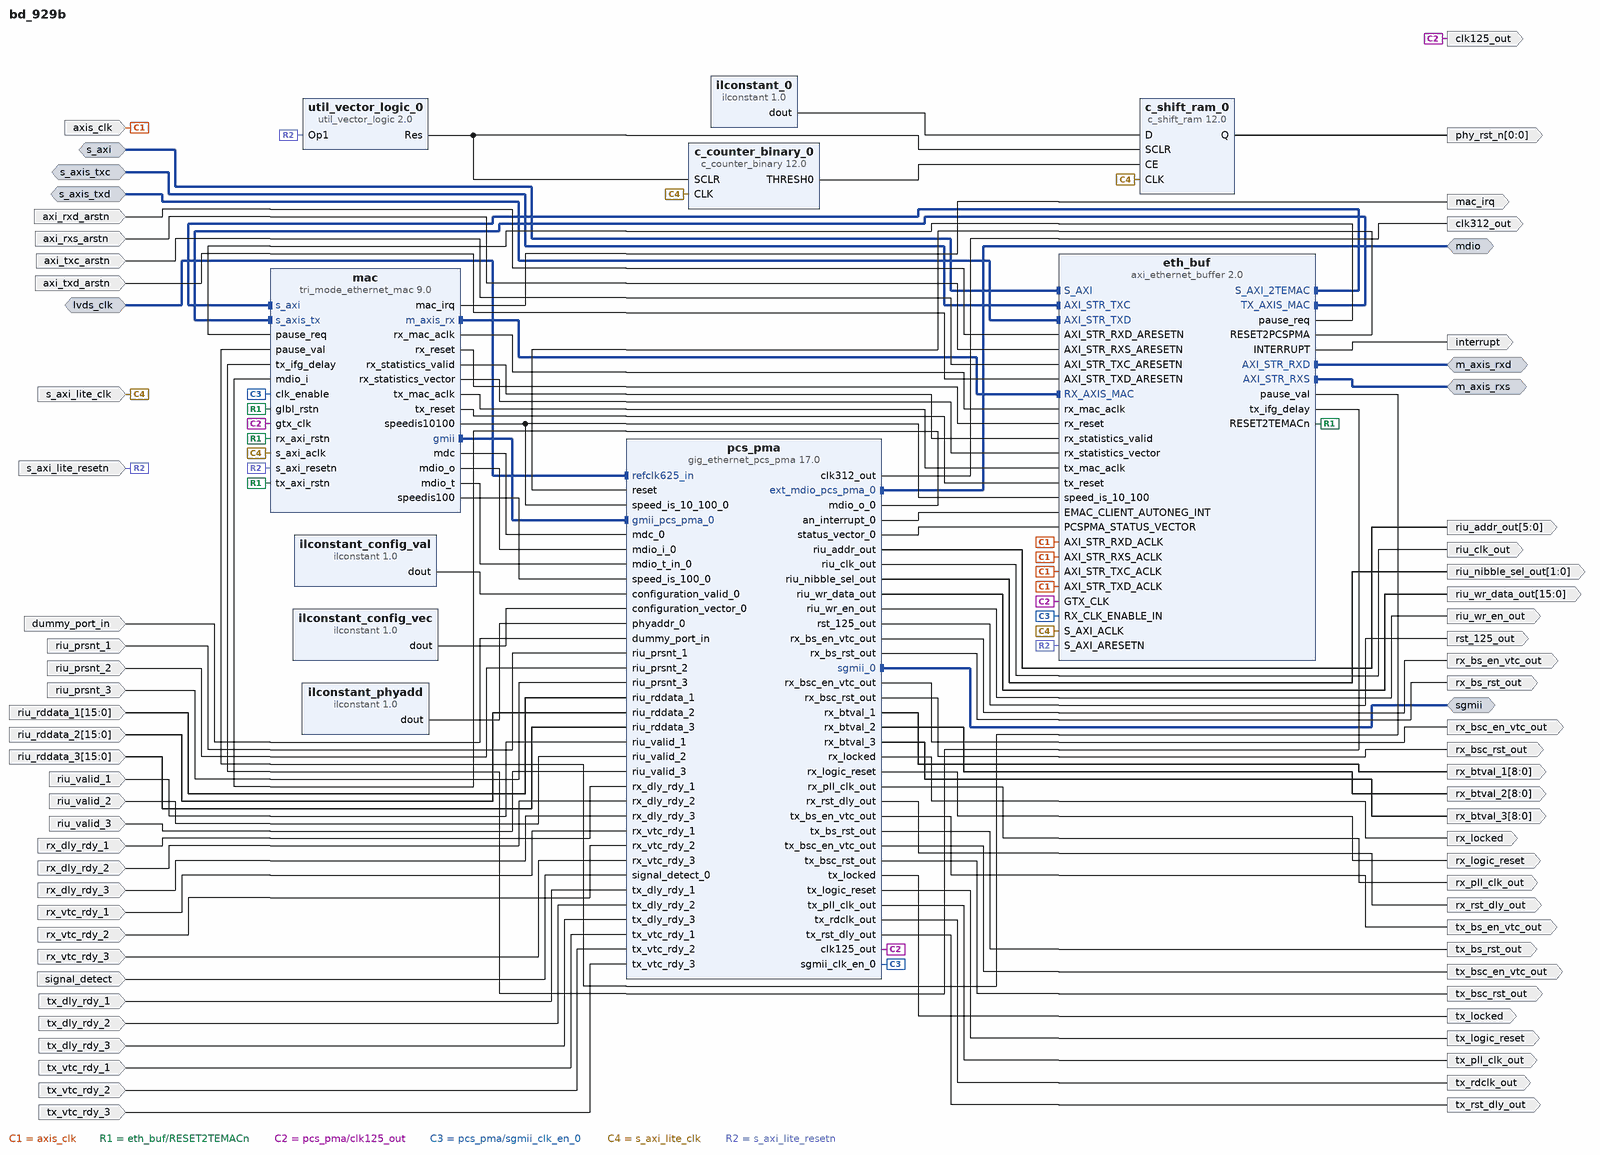
[diagram p0: block diagram of the top level]
# Vivado block design bd_929b, xcvu37p-fsvh2892-2L-e, Vivado 2025.2
create_bd_design bd_929b

create_bd_intf_port -mode Slave -vlnv xilinx.com:interface:aximm_rtl:1.0 s_axi
set_property -dict {CONFIG.ADDR_WIDTH 18 CONFIG.PROTOCOL AXI4LITE} [get_bd_intf_ports s_axi]
create_bd_intf_port -mode Slave -vlnv xilinx.com:interface:axis_rtl:1.0 s_axis_txd
create_bd_intf_port -mode Slave -vlnv xilinx.com:interface:axis_rtl:1.0 s_axis_txc
create_bd_intf_port -mode Master -vlnv xilinx.com:interface:axis_rtl:1.0 m_axis_rxd
create_bd_intf_port -mode Master -vlnv xilinx.com:interface:axis_rtl:1.0 m_axis_rxs
create_bd_intf_port -mode Master -vlnv xilinx.com:interface:mdio_rtl:1.0 mdio
create_bd_intf_port -mode Master -vlnv xilinx.com:interface:sgmii_rtl:1.0 sgmii
create_bd_intf_port -mode Slave -vlnv xilinx.com:interface:diff_clock_rtl:1.0 lvds_clk
set_property -dict {CONFIG.TYPE ETH_LVDS_CLK} [get_bd_intf_ports lvds_clk]
create_bd_port -dir I -type rst s_axi_lite_resetn
set_property -dict {CONFIG.POLARITY ACTIVE_LOW} [get_bd_ports s_axi_lite_resetn]
create_bd_port -dir I -type clk s_axi_lite_clk
set_property -dict {CONFIG.ASSOCIATED_BUSIF s_axi CONFIG.ASSOCIATED_RESET s_axi_lite_resetn} [get_bd_ports s_axi_lite_clk]
create_bd_port -dir O -type intr mac_irq
set_property -dict {CONFIG.SENSITIVITY EDGE_RISING} [get_bd_ports mac_irq]
create_bd_port -dir I -type clk axis_clk
set_property -dict [list \
  CONFIG.ASSOCIATED_BUSIF m_axis_rxd:m_axis_rxs:s_axis_txc:s_axis_txd \
  CONFIG.ASSOCIATED_RESET axi_rxd_arstn:axi_rxs_arstn:axi_txc_arstn:axi_txd_arstn \
] [get_bd_ports axis_clk]
create_bd_port -dir I -type rst axi_txd_arstn
set_property -dict {CONFIG.POLARITY ACTIVE_LOW} [get_bd_ports axi_txd_arstn]
create_bd_port -dir I -type rst axi_txc_arstn
set_property -dict {CONFIG.POLARITY ACTIVE_LOW} [get_bd_ports axi_txc_arstn]
create_bd_port -dir I -type rst axi_rxd_arstn
set_property -dict {CONFIG.POLARITY ACTIVE_LOW} [get_bd_ports axi_rxd_arstn]
create_bd_port -dir I -type rst axi_rxs_arstn
set_property -dict {CONFIG.POLARITY ACTIVE_LOW} [get_bd_ports axi_rxs_arstn]
create_bd_port -dir O -type intr interrupt
set_property -dict {CONFIG.SENSITIVITY LEVEL_HIGH} [get_bd_ports interrupt]
create_bd_port -dir I signal_detect
create_bd_port -dir O -type clk clk125_out
set_property -dict {CONFIG.ASSOCIATED_RESET rst_125_out} [get_bd_ports clk125_out]
create_bd_port -dir O -type clk clk312_out
create_bd_port -dir O -type rst rst_125_out
set_property -dict {CONFIG.POLARITY ACTIVE_HIGH} [get_bd_ports rst_125_out]
create_bd_port -dir I riu_valid_3
create_bd_port -dir I riu_valid_2
create_bd_port -dir I riu_valid_1
create_bd_port -dir I riu_prsnt_3
create_bd_port -dir I riu_prsnt_2
create_bd_port -dir I riu_prsnt_1
create_bd_port -dir I -from 15 -to 0 riu_rddata_3
create_bd_port -dir I -from 15 -to 0 riu_rddata_2
create_bd_port -dir I -from 15 -to 0 riu_rddata_1
create_bd_port -dir I tx_dly_rdy_1
create_bd_port -dir I rx_dly_rdy_1
create_bd_port -dir I tx_vtc_rdy_1
create_bd_port -dir I rx_vtc_rdy_1
create_bd_port -dir I tx_dly_rdy_2
create_bd_port -dir I rx_dly_rdy_2
create_bd_port -dir I tx_vtc_rdy_2
create_bd_port -dir I rx_vtc_rdy_2
create_bd_port -dir I tx_dly_rdy_3
create_bd_port -dir I rx_dly_rdy_3
create_bd_port -dir I tx_vtc_rdy_3
create_bd_port -dir I rx_vtc_rdy_3
create_bd_port -dir O tx_logic_reset
create_bd_port -dir O rx_logic_reset
create_bd_port -dir O rx_locked
create_bd_port -dir O tx_locked
create_bd_port -dir O tx_bsc_rst_out
create_bd_port -dir O rx_bsc_rst_out
create_bd_port -dir O tx_bs_rst_out
create_bd_port -dir O rx_bs_rst_out
create_bd_port -dir O tx_rst_dly_out
create_bd_port -dir O rx_rst_dly_out
create_bd_port -dir O tx_bsc_en_vtc_out
create_bd_port -dir O tx_bs_en_vtc_out
create_bd_port -dir O rx_bsc_en_vtc_out
create_bd_port -dir O rx_bs_en_vtc_out
create_bd_port -dir O riu_clk_out
create_bd_port -dir O riu_wr_en_out
create_bd_port -dir O tx_pll_clk_out
create_bd_port -dir O rx_pll_clk_out
create_bd_port -dir O tx_rdclk_out
create_bd_port -dir O -from 5 -to 0 riu_addr_out
create_bd_port -dir O -from 15 -to 0 riu_wr_data_out
create_bd_port -dir O -from 1 -to 0 riu_nibble_sel_out
create_bd_port -dir O -from 8 -to 0 rx_btval_1
create_bd_port -dir O -from 8 -to 0 rx_btval_2
create_bd_port -dir O -from 8 -to 0 rx_btval_3
create_bd_port -dir I -type rst dummy_port_in
set_property -dict {CONFIG.POLARITY ACTIVE_HIGH} [get_bd_ports dummy_port_in]
create_bd_port -dir O -from 0 -to 0 -type rst phy_rst_n
set_property -dict {CONFIG.POLARITY ACTIVE_LOW} [get_bd_ports phy_rst_n]

create_bd_cell -type ip -vlnv xilinx.com:ip:axi_ethernet_buffer:2.0 eth_buf
set_property -dict [list \
  CONFIG.C_AVB 0 \
  CONFIG.C_PHYADDR 1 \
  CONFIG.C_PHY_TYPE 4 \
  CONFIG.C_STATS 1 \
  CONFIG.C_TYPE 1 \
  CONFIG.ENABLE_LVDS 1 \
  CONFIG.HAS_SGMII true \
  CONFIG.MCAST_EXTEND false \
  CONFIG.PHYRST_BOARD_INTERFACE Custom \
  CONFIG.RXCSUM None \
  CONFIG.RXMEM 4k \
  CONFIG.RXVLAN_STRP false \
  CONFIG.RXVLAN_TAG false \
  CONFIG.RXVLAN_TRAN false \
  CONFIG.SIMULATION_MODE false \
  CONFIG.SPEED_2P5 false \
  CONFIG.TXCSUM None \
  CONFIG.TXMEM 4k \
  CONFIG.TXVLAN_STRP false \
  CONFIG.TXVLAN_TAG false \
  CONFIG.TXVLAN_TRAN false \
  CONFIG.USE_BOARD_FLOW true \
  CONFIG.enable_1588 0 \
] [get_bd_cells eth_buf]
create_bd_cell -type ip -vlnv xilinx.com:ip:tri_mode_ethernet_mac:9.0 mac
set_property -dict [list \
  CONFIG.Data_Rate 1_Gbps \
  CONFIG.ETHERNET_BOARD_INTERFACE Custom \
  CONFIG.Enable_1588 false \
  CONFIG.Enable_AVB false \
  CONFIG.Enable_MDIO true \
  CONFIG.Enable_Priority_Flow_Control false \
  CONFIG.Frame_Filter true \
  CONFIG.Int_Mode_Type SGMII \
  CONFIG.MAC_Speed Tri_speed \
  CONFIG.MDIO_BOARD_INTERFACE Custom \
  CONFIG.Make_MDIO_External false \
  CONFIG.Management_Interface true \
  CONFIG.Number_of_Table_Entries 4 \
  CONFIG.Physical_Interface Internal \
  CONFIG.Statistics_Counters true \
  CONFIG.Statistics_Reset false \
  CONFIG.Statistics_Width 64bit \
  CONFIG.USE_BOARD_FLOW FALSE \
] [get_bd_cells mac]
create_bd_cell -type ip -vlnv xilinx.com:ip:gig_ethernet_pcs_pma:17.0 pcs_pma
set_property -dict [list \
  CONFIG.Auto_Negotiation TRUE \
  CONFIG.ClockSelection Sync \
  CONFIG.DIFFCLK_BOARD_INTERFACE sgmii_phyclk \
  CONFIG.DrpClkRate 50.0 \
  CONFIG.ETHERNET_BOARD_INTERFACE sgmii_lvds \
  CONFIG.EXAMPLE_SIMULATION 0 \
  CONFIG.EnableAsyncSGMII false \
  CONFIG.Enable_1588 false \
  CONFIG.GT_Location X0Y0 \
  CONFIG.GT_Type GTY \
  CONFIG.GTinEx false \
  CONFIG.IS_GT_WIZ_OLD 0 \
  CONFIG.InstantiateBitslice0 true \
  CONFIG.LvdsRefClk 625 \
  CONFIG.MDIO_BOARD_INTERFACE mdio_mdc \
  CONFIG.Management_Interface TRUE \
  CONFIG.MaxDataRate 1G \
  CONFIG.NumOfLanes 1 \
  CONFIG.RefClkRate 125 \
  CONFIG.RefClkSrc clk0 \
  CONFIG.RxLane0_Placement DIFF_PAIR_2 \
  CONFIG.RxNibbleBitslice0Used false \
  CONFIG.SGMII_Mode 10_100_1000 \
  CONFIG.SGMII_PHY_Mode FALSE \
  CONFIG.SupportLevel Include_Shared_Logic_in_Core \
  CONFIG.TransceiverControl false \
  CONFIG.TxLane0_Placement DIFF_PAIR_1 \
  CONFIG.Tx_In_Upper_Nibble 1 \
  CONFIG.USE_BOARD_FLOW true \
] [get_bd_cells pcs_pma]
create_bd_cell -type inline_hdl -vlnv xilinx.com:inline_hdl:ilconstant:1.0 ilconstant_phyadd
set_property -dict {CONFIG.CONST_VAL 1 CONFIG.CONST_WIDTH 5} [get_bd_cells ilconstant_phyadd]
create_bd_cell -type inline_hdl -vlnv xilinx.com:inline_hdl:ilconstant:1.0 ilconstant_config_vec
set_property -dict {CONFIG.CONST_VAL 16 CONFIG.CONST_WIDTH 5} [get_bd_cells ilconstant_config_vec]
create_bd_cell -type inline_hdl -vlnv xilinx.com:inline_hdl:ilconstant:1.0 ilconstant_config_val
set_property -dict {CONFIG.CONST_VAL 1 CONFIG.CONST_WIDTH 1} [get_bd_cells ilconstant_config_val]
create_bd_cell -type ip -vlnv xilinx.com:ip:c_shift_ram:12.0 c_shift_ram_0
set_property -dict [list \
  CONFIG.AsyncInitVal 0 \
  CONFIG.CE true \
  CONFIG.DefaultData 0 \
  CONFIG.Depth 1 \
  CONFIG.SCLR true \
  CONFIG.Width 1 \
] [get_bd_cells c_shift_ram_0]
create_bd_cell -type ip -vlnv xilinx.com:ip:c_counter_binary:12.0 c_counter_binary_0
set_property -dict [list \
  CONFIG.Final_Count_Value 300000 \
  CONFIG.Increment_Value 1 \
  CONFIG.Output_Width 24 \
  CONFIG.Restrict_Count true \
  CONFIG.SCLR true \
  CONFIG.Sync_Threshold_Output true \
  CONFIG.Threshold_Value 300000 \
] [get_bd_cells c_counter_binary_0]
create_bd_cell -type inline_hdl -vlnv xilinx.com:inline_hdl:ilconstant:1.0 ilconstant_0
create_bd_cell -type ip -vlnv xilinx.com:ip:util_vector_logic:2.0 util_vector_logic_0
set_property -dict {CONFIG.C_OPERATION not CONFIG.C_SIZE 1} [get_bd_cells util_vector_logic_0]

# ---- connections ----

connect_bd_intf_net [get_bd_intf_ports m_axis_rxd] [get_bd_intf_pins eth_buf/AXI_STR_RXD]
connect_bd_intf_net [get_bd_intf_ports m_axis_rxs] [get_bd_intf_pins eth_buf/AXI_STR_RXS]
connect_bd_intf_net [get_bd_intf_pins eth_buf/S_AXI_2TEMAC] [get_bd_intf_pins mac/s_axi]
connect_bd_intf_net [get_bd_intf_pins eth_buf/TX_AXIS_MAC] [get_bd_intf_pins mac/s_axis_tx]
connect_bd_intf_net [get_bd_intf_ports lvds_clk] [get_bd_intf_pins pcs_pma/refclk625_in]
connect_bd_intf_net [get_bd_intf_pins mac/gmii] [get_bd_intf_pins pcs_pma/gmii_pcs_pma_0]
connect_bd_intf_net [get_bd_intf_pins eth_buf/RX_AXIS_MAC] [get_bd_intf_pins mac/m_axis_rx]
connect_bd_intf_net [get_bd_intf_ports mdio] [get_bd_intf_pins pcs_pma/ext_mdio_pcs_pma_0]
connect_bd_intf_net [get_bd_intf_ports sgmii] [get_bd_intf_pins pcs_pma/sgmii_0]
connect_bd_intf_net [get_bd_intf_ports s_axi] [get_bd_intf_pins eth_buf/S_AXI]
connect_bd_intf_net [get_bd_intf_ports s_axis_txc] [get_bd_intf_pins eth_buf/AXI_STR_TXC]
connect_bd_intf_net [get_bd_intf_ports s_axis_txd] [get_bd_intf_pins eth_buf/AXI_STR_TXD]
connect_bd_net [get_bd_ports axi_rxd_arstn] [get_bd_pins eth_buf/AXI_STR_RXD_ARESETN]
connect_bd_net [get_bd_ports axi_rxs_arstn] [get_bd_pins eth_buf/AXI_STR_RXS_ARESETN]
connect_bd_net [get_bd_ports axi_txc_arstn] [get_bd_pins eth_buf/AXI_STR_TXC_ARESETN]
connect_bd_net [get_bd_ports axi_txd_arstn] [get_bd_pins eth_buf/AXI_STR_TXD_ARESETN]
connect_bd_net [get_bd_ports axis_clk] \
  [get_bd_pins eth_buf/AXI_STR_RXS_ACLK] [get_bd_pins eth_buf/AXI_STR_RXD_ACLK] [get_bd_pins eth_buf/AXI_STR_TXC_ACLK] \
  [get_bd_pins eth_buf/AXI_STR_TXD_ACLK]
connect_bd_net [get_bd_pins c_counter_binary_0/THRESH0] [get_bd_pins c_shift_ram_0/CE]
connect_bd_net [get_bd_pins c_shift_ram_0/Q] [get_bd_ports phy_rst_n]
connect_bd_net [get_bd_ports dummy_port_in] [get_bd_pins pcs_pma/dummy_port_in]
connect_bd_net [get_bd_pins eth_buf/INTERRUPT] [get_bd_ports interrupt]
connect_bd_net [get_bd_pins eth_buf/RESET2PCSPMA] [get_bd_pins pcs_pma/reset]
connect_bd_net [get_bd_pins eth_buf/RESET2TEMACn] [get_bd_pins mac/glbl_rstn] [get_bd_pins mac/rx_axi_rstn] [get_bd_pins mac/tx_axi_rstn]
connect_bd_net [get_bd_pins eth_buf/pause_req] [get_bd_pins mac/pause_req]
connect_bd_net [get_bd_pins eth_buf/pause_val] [get_bd_pins mac/pause_val]
connect_bd_net [get_bd_pins eth_buf/tx_ifg_delay] [get_bd_pins mac/tx_ifg_delay]
connect_bd_net [get_bd_pins ilconstant_0/dout] [get_bd_pins c_shift_ram_0/D]
connect_bd_net [get_bd_pins ilconstant_config_val/dout] [get_bd_pins pcs_pma/configuration_valid_0]
connect_bd_net [get_bd_pins ilconstant_config_vec/dout] [get_bd_pins pcs_pma/configuration_vector_0]
connect_bd_net [get_bd_pins ilconstant_phyadd/dout] [get_bd_pins pcs_pma/phyaddr_0]
connect_bd_net [get_bd_pins mac/mac_irq] [get_bd_ports mac_irq]
connect_bd_net [get_bd_pins mac/mdc] [get_bd_pins pcs_pma/mdc_0]
connect_bd_net [get_bd_pins mac/mdio_o] [get_bd_pins pcs_pma/mdio_i_0]
connect_bd_net [get_bd_pins mac/mdio_t] [get_bd_pins pcs_pma/mdio_t_in_0]
connect_bd_net [get_bd_pins mac/rx_mac_aclk] [get_bd_pins eth_buf/rx_mac_aclk]
connect_bd_net [get_bd_pins mac/rx_reset] [get_bd_pins eth_buf/rx_reset]
connect_bd_net [get_bd_pins mac/rx_statistics_valid] [get_bd_pins eth_buf/rx_statistics_valid]
connect_bd_net [get_bd_pins mac/rx_statistics_vector] [get_bd_pins eth_buf/rx_statistics_vector]
connect_bd_net [get_bd_pins mac/speedis100] [get_bd_pins pcs_pma/speed_is_100_0]
connect_bd_net [get_bd_pins mac/speedis10100] [get_bd_pins eth_buf/speed_is_10_100] [get_bd_pins pcs_pma/speed_is_10_100_0]
connect_bd_net [get_bd_pins mac/tx_mac_aclk] [get_bd_pins eth_buf/tx_mac_aclk]
connect_bd_net [get_bd_pins mac/tx_reset] [get_bd_pins eth_buf/tx_reset]
connect_bd_net [get_bd_pins pcs_pma/an_interrupt_0] [get_bd_pins eth_buf/EMAC_CLIENT_AUTONEG_INT]
connect_bd_net [get_bd_pins pcs_pma/clk125_out] [get_bd_ports clk125_out] [get_bd_pins eth_buf/GTX_CLK] [get_bd_pins mac/gtx_clk]
connect_bd_net [get_bd_pins pcs_pma/clk312_out] [get_bd_ports clk312_out]
connect_bd_net [get_bd_pins pcs_pma/mdio_o_0] [get_bd_pins mac/mdio_i]
connect_bd_net [get_bd_pins pcs_pma/riu_addr_out] [get_bd_ports riu_addr_out]
connect_bd_net [get_bd_pins pcs_pma/riu_clk_out] [get_bd_ports riu_clk_out]
connect_bd_net [get_bd_pins pcs_pma/riu_nibble_sel_out] [get_bd_ports riu_nibble_sel_out]
connect_bd_net [get_bd_pins pcs_pma/riu_wr_data_out] [get_bd_ports riu_wr_data_out]
connect_bd_net [get_bd_pins pcs_pma/riu_wr_en_out] [get_bd_ports riu_wr_en_out]
connect_bd_net [get_bd_pins pcs_pma/rst_125_out] [get_bd_ports rst_125_out]
connect_bd_net [get_bd_pins pcs_pma/rx_bs_en_vtc_out] [get_bd_ports rx_bs_en_vtc_out]
connect_bd_net [get_bd_pins pcs_pma/rx_bs_rst_out] [get_bd_ports rx_bs_rst_out]
connect_bd_net [get_bd_pins pcs_pma/rx_bsc_en_vtc_out] [get_bd_ports rx_bsc_en_vtc_out]
connect_bd_net [get_bd_pins pcs_pma/rx_bsc_rst_out] [get_bd_ports rx_bsc_rst_out]
connect_bd_net [get_bd_pins pcs_pma/rx_btval_1] [get_bd_ports rx_btval_1]
connect_bd_net [get_bd_pins pcs_pma/rx_btval_2] [get_bd_ports rx_btval_2]
connect_bd_net [get_bd_pins pcs_pma/rx_btval_3] [get_bd_ports rx_btval_3]
connect_bd_net [get_bd_pins pcs_pma/rx_locked] [get_bd_ports rx_locked]
connect_bd_net [get_bd_pins pcs_pma/rx_logic_reset] [get_bd_ports rx_logic_reset]
connect_bd_net [get_bd_pins pcs_pma/rx_pll_clk_out] [get_bd_ports rx_pll_clk_out]
connect_bd_net [get_bd_pins pcs_pma/rx_rst_dly_out] [get_bd_ports rx_rst_dly_out]
connect_bd_net [get_bd_pins pcs_pma/sgmii_clk_en_0] [get_bd_pins mac/clk_enable] [get_bd_pins eth_buf/RX_CLK_ENABLE_IN]
connect_bd_net [get_bd_pins pcs_pma/status_vector_0] [get_bd_pins eth_buf/PCSPMA_STATUS_VECTOR]
connect_bd_net [get_bd_pins pcs_pma/tx_bs_en_vtc_out] [get_bd_ports tx_bs_en_vtc_out]
connect_bd_net [get_bd_pins pcs_pma/tx_bs_rst_out] [get_bd_ports tx_bs_rst_out]
connect_bd_net [get_bd_pins pcs_pma/tx_bsc_en_vtc_out] [get_bd_ports tx_bsc_en_vtc_out]
connect_bd_net [get_bd_pins pcs_pma/tx_bsc_rst_out] [get_bd_ports tx_bsc_rst_out]
connect_bd_net [get_bd_pins pcs_pma/tx_locked] [get_bd_ports tx_locked]
connect_bd_net [get_bd_pins pcs_pma/tx_logic_reset] [get_bd_ports tx_logic_reset]
connect_bd_net [get_bd_pins pcs_pma/tx_pll_clk_out] [get_bd_ports tx_pll_clk_out]
connect_bd_net [get_bd_pins pcs_pma/tx_rdclk_out] [get_bd_ports tx_rdclk_out]
connect_bd_net [get_bd_pins pcs_pma/tx_rst_dly_out] [get_bd_ports tx_rst_dly_out]
connect_bd_net -net riu_prsnt_1_1 [get_bd_ports riu_prsnt_1] [get_bd_pins pcs_pma/riu_prsnt_1]
connect_bd_net -net riu_prsnt_2_1 [get_bd_ports riu_prsnt_2] [get_bd_pins pcs_pma/riu_prsnt_2]
connect_bd_net -net riu_prsnt_3_1 [get_bd_ports riu_prsnt_3] [get_bd_pins pcs_pma/riu_prsnt_3]
connect_bd_net -net riu_rddata_1_1 [get_bd_ports riu_rddata_1] [get_bd_pins pcs_pma/riu_rddata_1]
connect_bd_net -net riu_rddata_2_1 [get_bd_ports riu_rddata_2] [get_bd_pins pcs_pma/riu_rddata_2]
connect_bd_net -net riu_rddata_3_1 [get_bd_ports riu_rddata_3] [get_bd_pins pcs_pma/riu_rddata_3]
connect_bd_net -net riu_valid_1_1 [get_bd_ports riu_valid_1] [get_bd_pins pcs_pma/riu_valid_1]
connect_bd_net -net riu_valid_2_1 [get_bd_ports riu_valid_2] [get_bd_pins pcs_pma/riu_valid_2]
connect_bd_net -net riu_valid_3_1 [get_bd_ports riu_valid_3] [get_bd_pins pcs_pma/riu_valid_3]
connect_bd_net -net rx_dly_rdy_1_1 [get_bd_ports rx_dly_rdy_1] [get_bd_pins pcs_pma/rx_dly_rdy_1]
connect_bd_net -net rx_dly_rdy_2_1 [get_bd_ports rx_dly_rdy_2] [get_bd_pins pcs_pma/rx_dly_rdy_2]
connect_bd_net -net rx_dly_rdy_3_1 [get_bd_ports rx_dly_rdy_3] [get_bd_pins pcs_pma/rx_dly_rdy_3]
connect_bd_net -net rx_vtc_rdy_1_1 [get_bd_ports rx_vtc_rdy_1] [get_bd_pins pcs_pma/rx_vtc_rdy_1]
connect_bd_net -net rx_vtc_rdy_2_1 [get_bd_ports rx_vtc_rdy_2] [get_bd_pins pcs_pma/rx_vtc_rdy_2]
connect_bd_net -net rx_vtc_rdy_3_1 [get_bd_ports rx_vtc_rdy_3] [get_bd_pins pcs_pma/rx_vtc_rdy_3]
connect_bd_net [get_bd_ports s_axi_lite_clk] \
  [get_bd_pins c_shift_ram_0/CLK] [get_bd_pins c_counter_binary_0/CLK] [get_bd_pins eth_buf/S_AXI_ACLK] \
  [get_bd_pins mac/s_axi_aclk]
connect_bd_net [get_bd_ports s_axi_lite_resetn] \
  [get_bd_pins util_vector_logic_0/Op1] [get_bd_pins eth_buf/S_AXI_ARESETN] [get_bd_pins mac/s_axi_resetn]
connect_bd_net [get_bd_ports signal_detect] [get_bd_pins pcs_pma/signal_detect_0]
connect_bd_net -net tx_dly_rdy_1_1 [get_bd_ports tx_dly_rdy_1] [get_bd_pins pcs_pma/tx_dly_rdy_1]
connect_bd_net -net tx_dly_rdy_2_1 [get_bd_ports tx_dly_rdy_2] [get_bd_pins pcs_pma/tx_dly_rdy_2]
connect_bd_net -net tx_dly_rdy_3_1 [get_bd_ports tx_dly_rdy_3] [get_bd_pins pcs_pma/tx_dly_rdy_3]
connect_bd_net -net tx_vtc_rdy_1_1 [get_bd_ports tx_vtc_rdy_1] [get_bd_pins pcs_pma/tx_vtc_rdy_1]
connect_bd_net -net tx_vtc_rdy_2_1 [get_bd_ports tx_vtc_rdy_2] [get_bd_pins pcs_pma/tx_vtc_rdy_2]
connect_bd_net -net tx_vtc_rdy_3_1 [get_bd_ports tx_vtc_rdy_3] [get_bd_pins pcs_pma/tx_vtc_rdy_3]
connect_bd_net [get_bd_pins util_vector_logic_0/Res] [get_bd_pins c_shift_ram_0/SCLR] [get_bd_pins c_counter_binary_0/SCLR]

# ---- address map ----
assign_bd_address -offset 0x00000 -range 4K -target_address_space [get_bd_addr_spaces eth_buf/S_AXI_2TEMAC] [get_bd_addr_segs mac/s_axi/Reg]
assign_bd_address -offset 0x00000 -range 256K -target_address_space [get_bd_addr_spaces s_axi] [get_bd_addr_segs eth_buf/S_AXI/Reg]

validate_bd_design
save_bd_design
